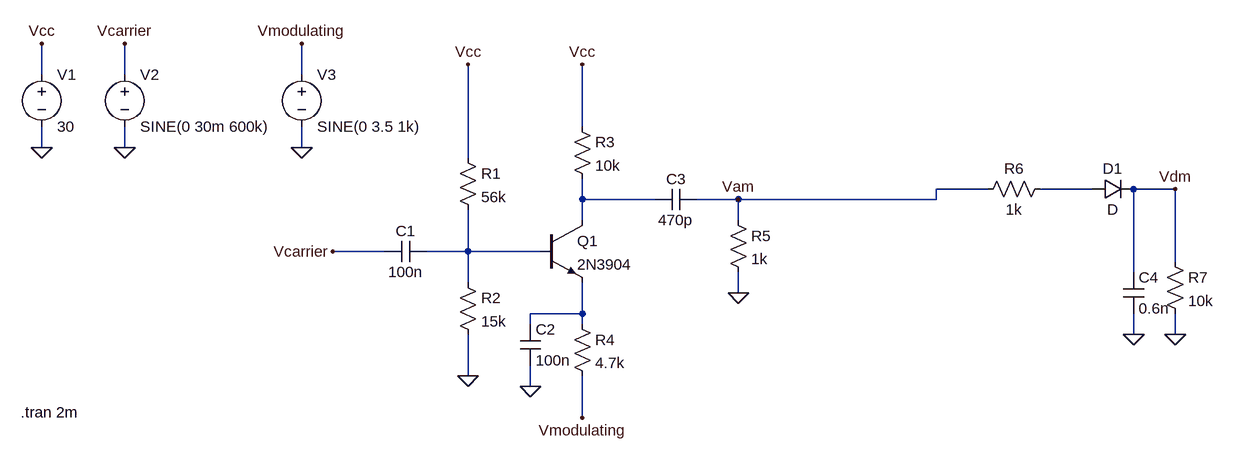
[diagram p0: schematic AM-modulator-bjt.asc]
AM-modulator-bjt.asc, the LTspice schematic file:
Version 4
SHEET 1 1780 752
WIRE -32 32 -32 -16
WIRE 96 32 96 -16
WIRE 368 32 368 -16
WIRE 800 112 800 16
WIRE -32 144 -32 112
WIRE 96 144 96 112
WIRE 368 144 368 112
WIRE 624 160 624 16
WIRE 1424 208 1344 208
WIRE 1584 208 1504 208
WIRE 1712 208 1648 208
WIRE 800 224 800 192
WIRE 912 224 800 224
WIRE 1040 224 976 224
WIRE 1344 224 1344 208
WIRE 1344 224 1040 224
WIRE 800 256 800 224
WIRE 1040 256 1040 224
WIRE 496 304 416 304
WIRE 624 304 624 240
WIRE 624 304 560 304
WIRE 736 304 624 304
WIRE 1712 320 1712 208
WIRE 1648 336 1648 208
WIRE 624 352 624 304
WIRE 1040 368 1040 336
WIRE 800 400 800 352
WIRE 800 400 720 400
WIRE 720 416 720 400
WIRE 800 416 800 400
WIRE 1648 432 1648 400
WIRE 1712 432 1712 400
WIRE 624 496 624 432
WIRE 720 512 720 480
WIRE 800 560 800 496
FLAG -32 144 0
FLAG 96 144 0
FLAG 368 144 0
FLAG -32 -16 Vcc
FLAG 96 -16 Vcarrier
FLAG 368 -16 Vmodulating
FLAG 624 16 Vcc
FLAG 800 16 Vcc
FLAG 624 496 0
FLAG 416 304 Vcarrier
FLAG 800 560 Vmodulating
FLAG 720 512 0
FLAG 1040 368 0
FLAG 1040 224 Vam
FLAG 1648 432 0
FLAG 1712 432 0
FLAG 1712 208 Vdm
SYMBOL voltage -32 16 R0
WINDOW 123 0 0 Left 0
WINDOW 39 0 0 Left 0
SYMATTR InstName V1
SYMATTR Value 30
SYMBOL voltage 96 16 R0
WINDOW 123 0 0 Left 0
WINDOW 39 0 0 Left 0
SYMATTR InstName V2
SYMATTR Value SINE(0 30m 600k)
SYMBOL voltage 368 16 R0
WINDOW 123 0 0 Left 0
WINDOW 39 0 0 Left 0
SYMATTR InstName V3
SYMATTR Value SINE(0 3.5 1k)
SYMBOL res 608 144 R0
SYMATTR InstName R1
SYMATTR Value 56k
SYMBOL res 608 336 R0
SYMATTR InstName R2
SYMATTR Value 15k
SYMBOL cap 560 288 R90
WINDOW 0 0 32 VBottom 2
WINDOW 3 32 32 VTop 2
SYMATTR InstName C1
SYMATTR Value 100n
SYMBOL npn 736 256 R0
SYMATTR InstName Q1
SYMATTR Value 2N3904
SYMBOL res 784 96 R0
SYMATTR InstName R3
SYMATTR Value 10k
SYMBOL res 784 400 R0
SYMATTR InstName R4
SYMATTR Value 4.7k
SYMBOL cap 704 416 R0
SYMATTR InstName C2
SYMATTR Value 100n
SYMBOL cap 976 208 R90
WINDOW 0 0 32 VBottom 2
WINDOW 3 32 32 VTop 2
SYMATTR InstName C3
SYMATTR Value 470p
SYMBOL res 1024 240 R0
SYMATTR InstName R5
SYMATTR Value 1k
SYMBOL res 1520 192 R90
WINDOW 0 0 56 VBottom 2
WINDOW 3 32 56 VTop 2
SYMATTR InstName R6
SYMATTR Value 1k
SYMBOL diode 1584 224 R270
WINDOW 0 32 32 VTop 2
WINDOW 3 0 32 VBottom 2
SYMATTR InstName D1
SYMBOL res 1696 304 R0
SYMATTR InstName R7
SYMATTR Value 10k
SYMBOL cap 1632 336 R0
SYMATTR InstName C4
SYMATTR Value 0.6n
TEXT -64 552 Left 2 !.tran 2m

The netlist it stands for:
* AM-modulator-bjt.asc
V1 Vcc 0 30
V2 Vcarrier 0 SINE(0 30m 600k)
V3 Vmodulating 0 SINE(0 3.5 1k)
R1 Vcc N003 56k
R2 N003 0 15k
C1 N003 Vcarrier 100n
Q1 N002 N003 N004 0 2N3904
R3 Vcc N002 10k
R4 N004 Vmodulating 4.7k
C2 N004 0 100n
C3 Vam N002 470p
R5 Vam 0 1k
R6 N001 Vam 1k
D1 N001 Vdm D
R7 Vdm 0 10k
C4 Vdm 0 0.6n
.model D D
.lib standard.dio
.model NPN NPN
.model PNP PNP
.lib standard.bjt
.tran 2m
.backanno
.end